# Altium schematic sheet Top.SchDoc: HPBI Controller (part 2 of 2)
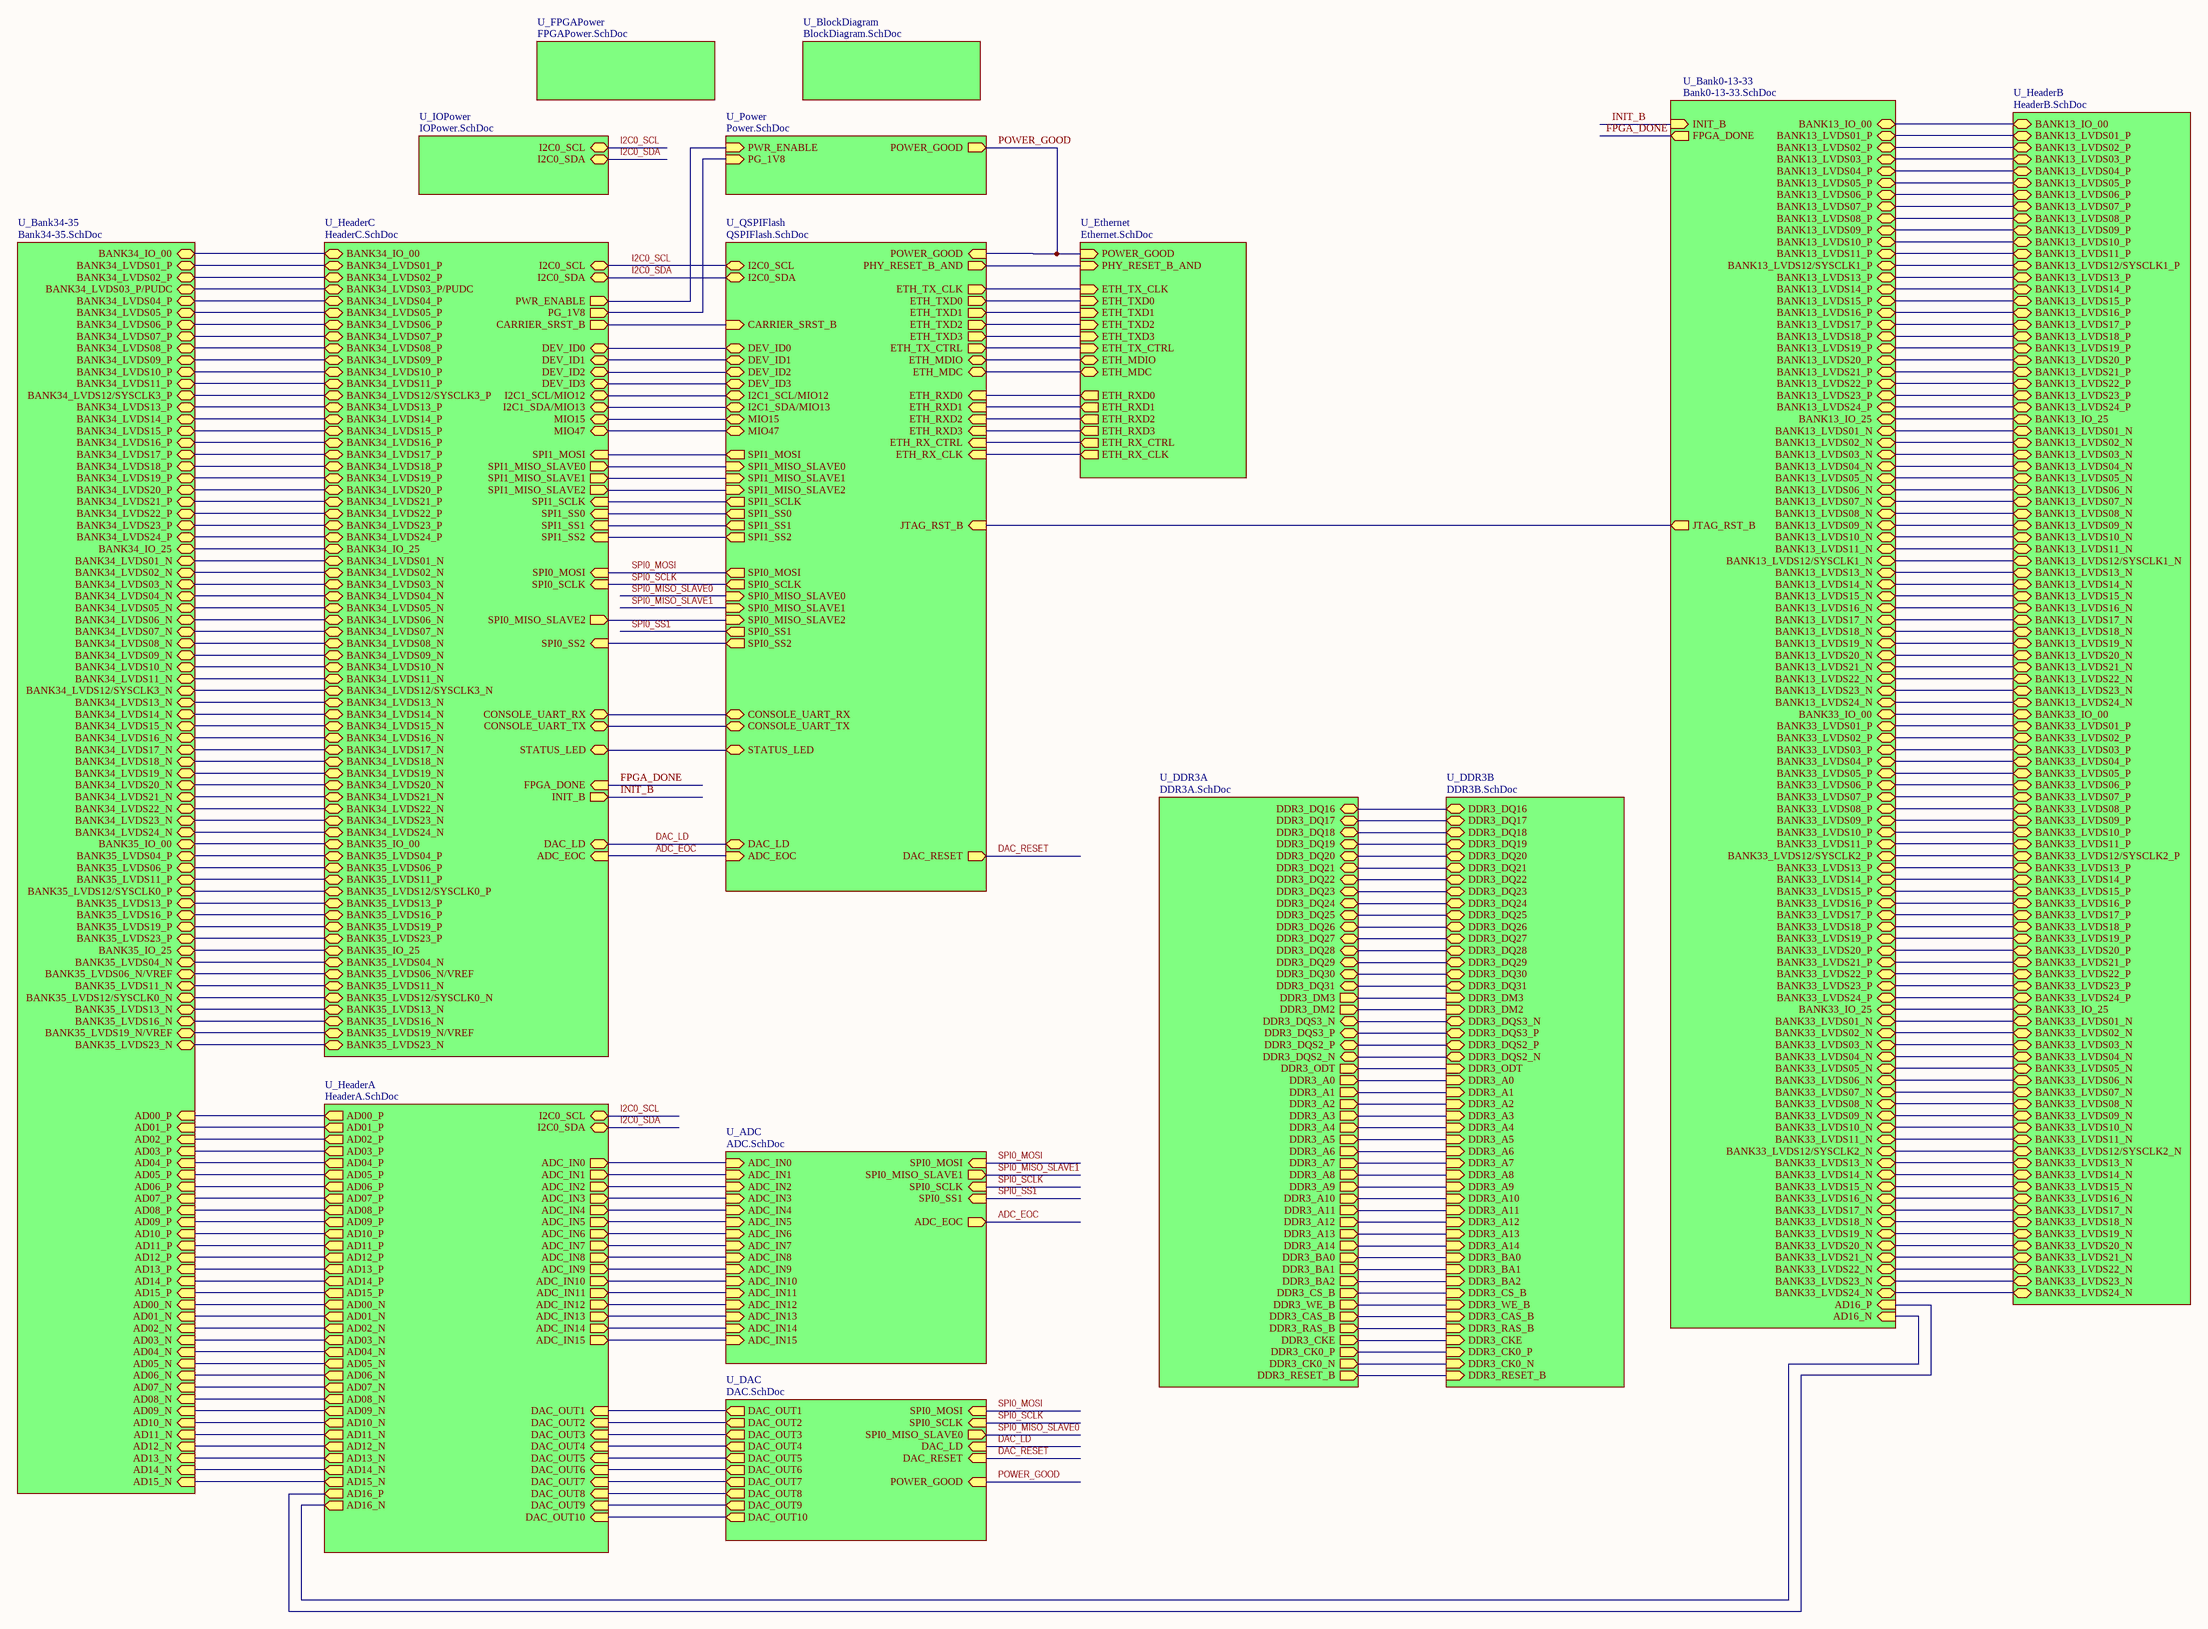
[diagram p1: Top.SchDoc]

## Nets
ADC_EOC: sheet U_ADC/ADC_EOC, sheet U_HeaderC/ADC_EOC, sheet U_QSPIFlash/ADC_EOC
DAC_LD: sheet U_DAC/DAC_LD, sheet U_HeaderC/DAC_LD, sheet U_QSPIFlash/DAC_LD
DAC_RESET: sheet U_DAC/DAC_RESET, sheet U_QSPIFlash/DAC_RESET
FPGA_DONE: sheet U_Bank0-13-33/FPGA_DONE, sheet U_HeaderC/FPGA_DONE
I2C0_SCL: sheet U_HeaderA/I2C0_SCL, sheet U_HeaderC/I2C0_SCL, sheet U_IOPower/I2C0_SCL, sheet U_QSPIFlash/I2C0_SCL
I2C0_SDA: sheet U_HeaderA/I2C0_SDA, sheet U_HeaderC/I2C0_SDA, sheet U_IOPower/I2C0_SDA, sheet U_QSPIFlash/I2C0_SDA
INIT_B: sheet U_Bank0-13-33/INIT_B, sheet U_HeaderC/INIT_B
POWER_GOOD: sheet U_DAC/POWER_GOOD, sheet U_Ethernet/POWER_GOOD, sheet U_QSPIFlash/POWER_GOOD, sheet U_Power/POWER_GOOD
SPI0_MISO_SLAVE0: sheet U_DAC/SPI0_MISO_SLAVE0, sheet U_QSPIFlash/SPI0_MISO_SLAVE0
SPI0_MISO_SLAVE1: sheet U_ADC/SPI0_MISO_SLAVE1, sheet U_QSPIFlash/SPI0_MISO_SLAVE1
SPI0_MOSI: sheet U_ADC/SPI0_MOSI, sheet U_DAC/SPI0_MOSI, sheet U_HeaderC/SPI0_MOSI, sheet U_QSPIFlash/SPI0_MOSI
SPI0_SCLK: sheet U_ADC/SPI0_SCLK, sheet U_DAC/SPI0_SCLK, sheet U_HeaderC/SPI0_SCLK, sheet U_QSPIFlash/SPI0_SCLK
SPI0_SS1: sheet U_ADC/SPI0_SS1, sheet U_QSPIFlash/SPI0_SS1
(unnamed): sheet U_ADC/ADC_IN0, sheet U_HeaderA/ADC_IN0
(unnamed): sheet U_ADC/ADC_IN1, sheet U_HeaderA/ADC_IN1
(unnamed): sheet U_ADC/ADC_IN2, sheet U_HeaderA/ADC_IN2
(unnamed): sheet U_ADC/ADC_IN3, sheet U_HeaderA/ADC_IN3
(unnamed): sheet U_ADC/ADC_IN4, sheet U_HeaderA/ADC_IN4
(unnamed): sheet U_ADC/ADC_IN5, sheet U_HeaderA/ADC_IN5
(unnamed): sheet U_ADC/ADC_IN6, sheet U_HeaderA/ADC_IN6
(unnamed): sheet U_ADC/ADC_IN7, sheet U_HeaderA/ADC_IN7
(unnamed): sheet U_ADC/ADC_IN8, sheet U_HeaderA/ADC_IN8
(unnamed): sheet U_ADC/ADC_IN9, sheet U_HeaderA/ADC_IN9
(unnamed): sheet U_ADC/ADC_IN10, sheet U_HeaderA/ADC_IN10
(unnamed): sheet U_ADC/ADC_IN11, sheet U_HeaderA/ADC_IN11
(unnamed): sheet U_ADC/ADC_IN12, sheet U_HeaderA/ADC_IN12
(unnamed): sheet U_ADC/ADC_IN13, sheet U_HeaderA/ADC_IN13
(unnamed): sheet U_ADC/ADC_IN14, sheet U_HeaderA/ADC_IN14
(unnamed): sheet U_ADC/ADC_IN15, sheet U_HeaderA/ADC_IN15
(unnamed): sheet U_Bank0-13-33/BANK13_IO_00, sheet U_HeaderB/BANK13_IO_00
(unnamed): sheet U_Bank0-13-33/BANK13_LVDS01_P, sheet U_HeaderB/BANK13_LVDS01_P
(unnamed): sheet U_Bank0-13-33/BANK13_LVDS02_P, sheet U_HeaderB/BANK13_LVDS02_P
(unnamed): sheet U_Bank0-13-33/BANK13_LVDS03_P, sheet U_HeaderB/BANK13_LVDS03_P
(unnamed): sheet U_Bank0-13-33/BANK13_LVDS04_P, sheet U_HeaderB/BANK13_LVDS04_P
(unnamed): sheet U_Bank0-13-33/BANK13_LVDS05_P, sheet U_HeaderB/BANK13_LVDS05_P
(unnamed): sheet U_Bank0-13-33/BANK13_LVDS06_P, sheet U_HeaderB/BANK13_LVDS06_P
(unnamed): sheet U_Bank0-13-33/BANK13_LVDS07_P, sheet U_HeaderB/BANK13_LVDS07_P
(unnamed): sheet U_Bank0-13-33/BANK13_LVDS08_P, sheet U_HeaderB/BANK13_LVDS08_P
(unnamed): sheet U_Bank0-13-33/BANK13_LVDS09_P, sheet U_HeaderB/BANK13_LVDS09_P
(unnamed): sheet U_Bank0-13-33/BANK13_LVDS10_P, sheet U_HeaderB/BANK13_LVDS10_P
(unnamed): sheet U_Bank0-13-33/BANK13_LVDS11_P, sheet U_HeaderB/BANK13_LVDS11_P
(unnamed): sheet U_Bank0-13-33/BANK13_LVDS13_P, sheet U_HeaderB/BANK13_LVDS13_P
(unnamed): sheet U_Bank0-13-33/BANK13_LVDS14_P, sheet U_HeaderB/BANK13_LVDS14_P
(unnamed): sheet U_Bank0-13-33/BANK13_LVDS15_P, sheet U_HeaderB/BANK13_LVDS15_P
(unnamed): sheet U_Bank0-13-33/BANK13_LVDS16_P, sheet U_HeaderB/BANK13_LVDS16_P
(unnamed): sheet U_Bank0-13-33/BANK13_LVDS17_P, sheet U_HeaderB/BANK13_LVDS17_P
(unnamed): sheet U_Bank0-13-33/BANK13_LVDS18_P, sheet U_HeaderB/BANK13_LVDS18_P
(unnamed): sheet U_Bank0-13-33/BANK13_LVDS19_P, sheet U_HeaderB/BANK13_LVDS19_P
(unnamed): sheet U_Bank0-13-33/BANK13_LVDS20_P, sheet U_HeaderB/BANK13_LVDS20_P
(unnamed): sheet U_Bank0-13-33/BANK13_LVDS21_P, sheet U_HeaderB/BANK13_LVDS21_P
(unnamed): sheet U_Bank0-13-33/BANK13_LVDS22_P, sheet U_HeaderB/BANK13_LVDS22_P
(unnamed): sheet U_Bank0-13-33/BANK13_LVDS23_P, sheet U_HeaderB/BANK13_LVDS23_P
(unnamed): sheet U_Bank0-13-33/BANK13_LVDS24_P, sheet U_HeaderB/BANK13_LVDS24_P
(unnamed): sheet U_Bank0-13-33/BANK13_IO_25, sheet U_HeaderB/BANK13_IO_25
(unnamed): sheet U_Bank0-13-33/BANK13_LVDS01_N, sheet U_HeaderB/BANK13_LVDS01_N
(unnamed): sheet U_Bank0-13-33/BANK13_LVDS02_N, sheet U_HeaderB/BANK13_LVDS02_N
(unnamed): sheet U_Bank0-13-33/BANK13_LVDS03_N, sheet U_HeaderB/BANK13_LVDS03_N
(unnamed): sheet U_Bank0-13-33/BANK13_LVDS04_N, sheet U_HeaderB/BANK13_LVDS04_N
(unnamed): sheet U_Bank0-13-33/BANK13_LVDS05_N, sheet U_HeaderB/BANK13_LVDS05_N
(unnamed): sheet U_Bank0-13-33/BANK13_LVDS06_N, sheet U_HeaderB/BANK13_LVDS06_N
(unnamed): sheet U_Bank0-13-33/BANK13_LVDS07_N, sheet U_HeaderB/BANK13_LVDS07_N
(unnamed): sheet U_Bank0-13-33/BANK13_LVDS08_N, sheet U_HeaderB/BANK13_LVDS08_N
(unnamed): sheet U_Bank0-13-33/BANK13_LVDS09_N, sheet U_HeaderB/BANK13_LVDS09_N
(unnamed): sheet U_Bank0-13-33/BANK13_LVDS10_N, sheet U_HeaderB/BANK13_LVDS10_N
(unnamed): sheet U_Bank0-13-33/BANK13_LVDS11_N, sheet U_HeaderB/BANK13_LVDS11_N
(unnamed): sheet U_Bank0-13-33/BANK13_LVDS13_N, sheet U_HeaderB/BANK13_LVDS13_N
(unnamed): sheet U_Bank0-13-33/BANK13_LVDS14_N, sheet U_HeaderB/BANK13_LVDS14_N
(unnamed): sheet U_Bank0-13-33/BANK13_LVDS15_N, sheet U_HeaderB/BANK13_LVDS15_N
(unnamed): sheet U_Bank0-13-33/BANK13_LVDS16_N, sheet U_HeaderB/BANK13_LVDS16_N
(unnamed): sheet U_Bank0-13-33/BANK13_LVDS17_N, sheet U_HeaderB/BANK13_LVDS17_N
(unnamed): sheet U_Bank0-13-33/BANK13_LVDS18_N, sheet U_HeaderB/BANK13_LVDS18_N
(unnamed): sheet U_Bank0-13-33/BANK13_LVDS19_N, sheet U_HeaderB/BANK13_LVDS19_N
(unnamed): sheet U_Bank0-13-33/BANK13_LVDS20_N, sheet U_HeaderB/BANK13_LVDS20_N
(unnamed): sheet U_Bank0-13-33/BANK13_LVDS21_N, sheet U_HeaderB/BANK13_LVDS21_N
(unnamed): sheet U_Bank0-13-33/BANK13_LVDS22_N, sheet U_HeaderB/BANK13_LVDS22_N
(unnamed): sheet U_Bank0-13-33/BANK13_LVDS23_N, sheet U_HeaderB/BANK13_LVDS23_N
(unnamed): sheet U_Bank0-13-33/BANK13_LVDS24_N, sheet U_HeaderB/BANK13_LVDS24_N
(unnamed): sheet U_Bank0-13-33/BANK33_IO_00, sheet U_HeaderB/BANK33_IO_00
(unnamed): sheet U_Bank0-13-33/BANK33_LVDS01_P, sheet U_HeaderB/BANK33_LVDS01_P
(unnamed): sheet U_Bank0-13-33/BANK33_LVDS02_P, sheet U_HeaderB/BANK33_LVDS02_P
(unnamed): sheet U_Bank0-13-33/BANK33_LVDS03_P, sheet U_HeaderB/BANK33_LVDS03_P
(unnamed): sheet U_Bank0-13-33/BANK33_LVDS04_P, sheet U_HeaderB/BANK33_LVDS04_P
(unnamed): sheet U_Bank0-13-33/BANK33_LVDS05_P, sheet U_HeaderB/BANK33_LVDS05_P
(unnamed): sheet U_Bank0-13-33/BANK33_LVDS06_P, sheet U_HeaderB/BANK33_LVDS06_P
(unnamed): sheet U_Bank0-13-33/BANK33_LVDS07_P, sheet U_HeaderB/BANK33_LVDS07_P
(unnamed): sheet U_Bank0-13-33/BANK33_LVDS08_P, sheet U_HeaderB/BANK33_LVDS08_P
(unnamed): sheet U_Bank0-13-33/BANK33_LVDS09_P, sheet U_HeaderB/BANK33_LVDS09_P
(unnamed): sheet U_Bank0-13-33/BANK33_LVDS10_P, sheet U_HeaderB/BANK33_LVDS10_P
(unnamed): sheet U_Bank0-13-33/BANK33_LVDS11_P, sheet U_HeaderB/BANK33_LVDS11_P
(unnamed): sheet U_Bank0-13-33/BANK33_LVDS13_P, sheet U_HeaderB/BANK33_LVDS13_P
(unnamed): sheet U_Bank0-13-33/BANK33_LVDS14_P, sheet U_HeaderB/BANK33_LVDS14_P
(unnamed): sheet U_Bank0-13-33/BANK33_LVDS15_P, sheet U_HeaderB/BANK33_LVDS15_P
(unnamed): sheet U_Bank0-13-33/BANK33_LVDS16_P, sheet U_HeaderB/BANK33_LVDS16_P
(unnamed): sheet U_Bank0-13-33/BANK33_LVDS17_P, sheet U_HeaderB/BANK33_LVDS17_P
(unnamed): sheet U_Bank0-13-33/BANK33_LVDS18_P, sheet U_HeaderB/BANK33_LVDS18_P
(unnamed): sheet U_Bank0-13-33/BANK33_LVDS19_P, sheet U_HeaderB/BANK33_LVDS19_P
(unnamed): sheet U_Bank0-13-33/BANK33_LVDS20_P, sheet U_HeaderB/BANK33_LVDS20_P
(unnamed): sheet U_Bank0-13-33/BANK33_LVDS21_P, sheet U_HeaderB/BANK33_LVDS21_P
(unnamed): sheet U_Bank0-13-33/BANK33_LVDS22_P, sheet U_HeaderB/BANK33_LVDS22_P
(unnamed): sheet U_Bank0-13-33/BANK33_LVDS23_P, sheet U_HeaderB/BANK33_LVDS23_P
(unnamed): sheet U_Bank0-13-33/BANK33_LVDS24_P, sheet U_HeaderB/BANK33_LVDS24_P
(unnamed): sheet U_Bank0-13-33/BANK33_IO_25, sheet U_HeaderB/BANK33_IO_25
(unnamed): sheet U_Bank0-13-33/BANK33_LVDS01_N, sheet U_HeaderB/BANK33_LVDS01_N
(unnamed): sheet U_Bank0-13-33/BANK33_LVDS02_N, sheet U_HeaderB/BANK33_LVDS02_N
(unnamed): sheet U_Bank0-13-33/BANK33_LVDS03_N, sheet U_HeaderB/BANK33_LVDS03_N
(unnamed): sheet U_Bank0-13-33/BANK33_LVDS04_N, sheet U_HeaderB/BANK33_LVDS04_N
(unnamed): sheet U_Bank0-13-33/BANK33_LVDS05_N, sheet U_HeaderB/BANK33_LVDS05_N
(unnamed): sheet U_Bank0-13-33/BANK33_LVDS06_N, sheet U_HeaderB/BANK33_LVDS06_N
(unnamed): sheet U_Bank0-13-33/BANK33_LVDS07_N, sheet U_HeaderB/BANK33_LVDS07_N
(unnamed): sheet U_Bank0-13-33/BANK33_LVDS08_N, sheet U_HeaderB/BANK33_LVDS08_N
(unnamed): sheet U_Bank0-13-33/BANK33_LVDS09_N, sheet U_HeaderB/BANK33_LVDS09_N
(unnamed): sheet U_Bank0-13-33/BANK33_LVDS10_N, sheet U_HeaderB/BANK33_LVDS10_N
(unnamed): sheet U_Bank0-13-33/BANK33_LVDS11_N, sheet U_HeaderB/BANK33_LVDS11_N
(unnamed): sheet U_Bank0-13-33/BANK33_LVDS13_N, sheet U_HeaderB/BANK33_LVDS13_N
(unnamed): sheet U_Bank0-13-33/BANK33_LVDS14_N, sheet U_HeaderB/BANK33_LVDS14_N
(unnamed): sheet U_Bank0-13-33/BANK33_LVDS15_N, sheet U_HeaderB/BANK33_LVDS15_N
(unnamed): sheet U_Bank0-13-33/BANK33_LVDS16_N, sheet U_HeaderB/BANK33_LVDS16_N
(unnamed): sheet U_Bank0-13-33/BANK33_LVDS17_N, sheet U_HeaderB/BANK33_LVDS17_N
(unnamed): sheet U_Bank0-13-33/BANK33_LVDS18_N, sheet U_HeaderB/BANK33_LVDS18_N
(unnamed): sheet U_Bank0-13-33/BANK33_LVDS19_N, sheet U_HeaderB/BANK33_LVDS19_N
(unnamed): sheet U_Bank0-13-33/BANK33_LVDS20_N, sheet U_HeaderB/BANK33_LVDS20_N
(unnamed): sheet U_Bank0-13-33/BANK33_LVDS21_N, sheet U_HeaderB/BANK33_LVDS21_N
(unnamed): sheet U_Bank0-13-33/BANK33_LVDS22_N, sheet U_HeaderB/BANK33_LVDS22_N
(unnamed): sheet U_Bank0-13-33/BANK33_LVDS23_N, sheet U_HeaderB/BANK33_LVDS23_N
(unnamed): sheet U_Bank0-13-33/BANK33_LVDS24_N, sheet U_HeaderB/BANK33_LVDS24_N
(unnamed): sheet U_Bank0-13-33/AD16_P, sheet U_HeaderA/AD16_P
(unnamed): sheet U_Bank0-13-33/AD16_N, sheet U_HeaderA/AD16_N
(unnamed): sheet U_Bank0-13-33/JTAG_RST_B, sheet U_QSPIFlash/JTAG_RST_B
(unnamed): sheet U_Bank0-13-33/BANK13_LVDS12/SYSCLK1_P, sheet U_HeaderB/BANK13_LVDS12/SYSCLK1_P
(unnamed): sheet U_Bank0-13-33/BANK13_LVDS12/SYSCLK1_N, sheet U_HeaderB/BANK13_LVDS12/SYSCLK1_N
(unnamed): sheet U_Bank0-13-33/BANK33_LVDS12/SYSCLK2_P, sheet U_HeaderB/BANK33_LVDS12/SYSCLK2_P
(unnamed): sheet U_Bank0-13-33/BANK33_LVDS12/SYSCLK2_N, sheet U_HeaderB/BANK33_LVDS12/SYSCLK2_N
(unnamed): sheet U_Bank34-35/BANK34_IO_00, sheet U_HeaderC/BANK34_IO_00
(unnamed): sheet U_Bank34-35/BANK34_LVDS01_P, sheet U_HeaderC/BANK34_LVDS01_P
(unnamed): sheet U_Bank34-35/BANK34_LVDS02_P, sheet U_HeaderC/BANK34_LVDS02_P
(unnamed): sheet U_Bank34-35/BANK34_LVDS03_P/PUDC, sheet U_HeaderC/BANK34_LVDS03_P/PUDC
(unnamed): sheet U_Bank34-35/BANK34_LVDS04_P, sheet U_HeaderC/BANK34_LVDS04_P
(unnamed): sheet U_Bank34-35/BANK34_LVDS05_P, sheet U_HeaderC/BANK34_LVDS05_P
(unnamed): sheet U_Bank34-35/BANK34_LVDS06_P, sheet U_HeaderC/BANK34_LVDS06_P
(unnamed): sheet U_Bank34-35/BANK34_LVDS07_P, sheet U_HeaderC/BANK34_LVDS07_P
(unnamed): sheet U_Bank34-35/BANK34_LVDS08_P, sheet U_HeaderC/BANK34_LVDS08_P
(unnamed): sheet U_Bank34-35/BANK34_LVDS09_P, sheet U_HeaderC/BANK34_LVDS09_P
(unnamed): sheet U_Bank34-35/BANK34_LVDS10_P, sheet U_HeaderC/BANK34_LVDS10_P
(unnamed): sheet U_Bank34-35/BANK34_LVDS11_P, sheet U_HeaderC/BANK34_LVDS11_P
(unnamed): sheet U_Bank34-35/BANK34_LVDS13_P, sheet U_HeaderC/BANK34_LVDS13_P
(unnamed): sheet U_Bank34-35/BANK34_LVDS14_P, sheet U_HeaderC/BANK34_LVDS14_P
(unnamed): sheet U_Bank34-35/BANK34_LVDS15_P, sheet U_HeaderC/BANK34_LVDS15_P
(unnamed): sheet U_Bank34-35/BANK34_LVDS16_P, sheet U_HeaderC/BANK34_LVDS16_P
(unnamed): sheet U_Bank34-35/BANK34_LVDS17_P, sheet U_HeaderC/BANK34_LVDS17_P
(unnamed): sheet U_Bank34-35/BANK34_LVDS18_P, sheet U_HeaderC/BANK34_LVDS18_P
(unnamed): sheet U_Bank34-35/BANK34_LVDS19_P, sheet U_HeaderC/BANK34_LVDS19_P
(unnamed): sheet U_Bank34-35/BANK34_LVDS20_P, sheet U_HeaderC/BANK34_LVDS20_P
(unnamed): sheet U_Bank34-35/BANK34_LVDS21_P, sheet U_HeaderC/BANK34_LVDS21_P
(unnamed): sheet U_Bank34-35/BANK34_LVDS22_P, sheet U_HeaderC/BANK34_LVDS22_P
(unnamed): sheet U_Bank34-35/BANK34_LVDS23_P, sheet U_HeaderC/BANK34_LVDS23_P
(unnamed): sheet U_Bank34-35/BANK34_LVDS24_P, sheet U_HeaderC/BANK34_LVDS24_P
(unnamed): sheet U_Bank34-35/BANK34_IO_25, sheet U_HeaderC/BANK34_IO_25
(unnamed): sheet U_Bank34-35/BANK34_LVDS01_N, sheet U_HeaderC/BANK34_LVDS01_N
(unnamed): sheet U_Bank34-35/BANK34_LVDS02_N, sheet U_HeaderC/BANK34_LVDS02_N
(unnamed): sheet U_Bank34-35/BANK34_LVDS03_N, sheet U_HeaderC/BANK34_LVDS03_N
(unnamed): sheet U_Bank34-35/BANK34_LVDS04_N, sheet U_HeaderC/BANK34_LVDS04_N
(unnamed): sheet U_Bank34-35/BANK34_LVDS05_N, sheet U_HeaderC/BANK34_LVDS05_N
(unnamed): sheet U_Bank34-35/BANK34_LVDS06_N, sheet U_HeaderC/BANK34_LVDS06_N
(unnamed): sheet U_Bank34-35/BANK34_LVDS07_N, sheet U_HeaderC/BANK34_LVDS07_N
(unnamed): sheet U_Bank34-35/BANK34_LVDS08_N, sheet U_HeaderC/BANK34_LVDS08_N
(unnamed): sheet U_Bank34-35/BANK34_LVDS09_N, sheet U_HeaderC/BANK34_LVDS09_N
(unnamed): sheet U_Bank34-35/BANK34_LVDS10_N, sheet U_HeaderC/BANK34_LVDS10_N
(unnamed): sheet U_Bank34-35/BANK34_LVDS11_N, sheet U_HeaderC/BANK34_LVDS11_N
(unnamed): sheet U_Bank34-35/BANK34_LVDS13_N, sheet U_HeaderC/BANK34_LVDS13_N
(unnamed): sheet U_Bank34-35/BANK34_LVDS14_N, sheet U_HeaderC/BANK34_LVDS14_N
(unnamed): sheet U_Bank34-35/BANK34_LVDS15_N, sheet U_HeaderC/BANK34_LVDS15_N
(unnamed): sheet U_Bank34-35/BANK34_LVDS16_N, sheet U_HeaderC/BANK34_LVDS16_N
(unnamed): sheet U_Bank34-35/BANK34_LVDS17_N, sheet U_HeaderC/BANK34_LVDS17_N
(unnamed): sheet U_Bank34-35/BANK34_LVDS18_N, sheet U_HeaderC/BANK34_LVDS18_N
(unnamed): sheet U_Bank34-35/BANK34_LVDS19_N, sheet U_HeaderC/BANK34_LVDS19_N
(unnamed): sheet U_Bank34-35/BANK34_LVDS20_N, sheet U_HeaderC/BANK34_LVDS20_N
(unnamed): sheet U_Bank34-35/BANK34_LVDS21_N, sheet U_HeaderC/BANK34_LVDS21_N
(unnamed): sheet U_Bank34-35/BANK34_LVDS22_N, sheet U_HeaderC/BANK34_LVDS22_N
(unnamed): sheet U_Bank34-35/BANK34_LVDS23_N, sheet U_HeaderC/BANK34_LVDS23_N
(unnamed): sheet U_Bank34-35/BANK34_LVDS24_N, sheet U_HeaderC/BANK34_LVDS24_N
(unnamed): sheet U_Bank34-35/BANK35_IO_00, sheet U_HeaderC/BANK35_IO_00
(unnamed): sheet U_Bank34-35/BANK35_LVDS04_P, sheet U_HeaderC/BANK35_LVDS04_P
(unnamed): sheet U_Bank34-35/BANK35_LVDS06_P, sheet U_HeaderC/BANK35_LVDS06_P
(unnamed): sheet U_Bank34-35/BANK35_LVDS11_P, sheet U_HeaderC/BANK35_LVDS11_P
(unnamed): sheet U_Bank34-35/BANK35_LVDS13_P, sheet U_HeaderC/BANK35_LVDS13_P
(unnamed): sheet U_Bank34-35/BANK35_LVDS16_P, sheet U_HeaderC/BANK35_LVDS16_P
(unnamed): sheet U_Bank34-35/BANK35_LVDS19_P, sheet U_HeaderC/BANK35_LVDS19_P
(unnamed): sheet U_Bank34-35/BANK35_LVDS23_P, sheet U_HeaderC/BANK35_LVDS23_P
(unnamed): sheet U_Bank34-35/BANK35_IO_25, sheet U_HeaderC/BANK35_IO_25
(unnamed): sheet U_Bank34-35/BANK35_LVDS04_N, sheet U_HeaderC/BANK35_LVDS04_N
(unnamed): sheet U_Bank34-35/BANK35_LVDS06_N/VREF, sheet U_HeaderC/BANK35_LVDS06_N/VREF
(unnamed): sheet U_Bank34-35/BANK35_LVDS11_N, sheet U_HeaderC/BANK35_LVDS11_N
(unnamed): sheet U_Bank34-35/BANK35_LVDS13_N, sheet U_HeaderC/BANK35_LVDS13_N
(unnamed): sheet U_Bank34-35/BANK35_LVDS16_N, sheet U_HeaderC/BANK35_LVDS16_N
(unnamed): sheet U_Bank34-35/BANK35_LVDS19_N/VREF, sheet U_HeaderC/BANK35_LVDS19_N/VREF
(unnamed): sheet U_Bank34-35/BANK35_LVDS23_N, sheet U_HeaderC/BANK35_LVDS23_N
(unnamed): sheet U_Bank34-35/AD00_P, sheet U_HeaderA/AD00_P
(unnamed): sheet U_Bank34-35/AD01_P, sheet U_HeaderA/AD01_P
(unnamed): sheet U_Bank34-35/AD02_P, sheet U_HeaderA/AD02_P
(unnamed): sheet U_Bank34-35/AD03_P, sheet U_HeaderA/AD03_P
(unnamed): sheet U_Bank34-35/AD04_P, sheet U_HeaderA/AD04_P
(unnamed): sheet U_Bank34-35/AD05_P, sheet U_HeaderA/AD05_P
(unnamed): sheet U_Bank34-35/AD06_P, sheet U_HeaderA/AD06_P
(unnamed): sheet U_Bank34-35/AD07_P, sheet U_HeaderA/AD07_P
(unnamed): sheet U_Bank34-35/AD08_P, sheet U_HeaderA/AD08_P
(unnamed): sheet U_Bank34-35/AD09_P, sheet U_HeaderA/AD09_P
(unnamed): sheet U_Bank34-35/AD10_P, sheet U_HeaderA/AD10_P
(unnamed): sheet U_Bank34-35/AD11_P, sheet U_HeaderA/AD11_P
(unnamed): sheet U_Bank34-35/AD12_P, sheet U_HeaderA/AD12_P
(unnamed): sheet U_Bank34-35/AD13_P, sheet U_HeaderA/AD13_P
(unnamed): sheet U_Bank34-35/AD14_P, sheet U_HeaderA/AD14_P
(unnamed): sheet U_Bank34-35/AD15_P, sheet U_HeaderA/AD15_P
(unnamed): sheet U_Bank34-35/AD00_N, sheet U_HeaderA/AD00_N
(unnamed): sheet U_Bank34-35/AD01_N, sheet U_HeaderA/AD01_N
(unnamed): sheet U_Bank34-35/AD02_N, sheet U_HeaderA/AD02_N
(unnamed): sheet U_Bank34-35/AD03_N, sheet U_HeaderA/AD03_N
(unnamed): sheet U_Bank34-35/AD04_N, sheet U_HeaderA/AD04_N
(unnamed): sheet U_Bank34-35/AD05_N, sheet U_HeaderA/AD05_N
(unnamed): sheet U_Bank34-35/AD06_N, sheet U_HeaderA/AD06_N
(unnamed): sheet U_Bank34-35/AD07_N, sheet U_HeaderA/AD07_N
(unnamed): sheet U_Bank34-35/AD08_N, sheet U_HeaderA/AD08_N
(unnamed): sheet U_Bank34-35/AD09_N, sheet U_HeaderA/AD09_N
(unnamed): sheet U_Bank34-35/AD10_N, sheet U_HeaderA/AD10_N
(unnamed): sheet U_Bank34-35/AD11_N, sheet U_HeaderA/AD11_N
(unnamed): sheet U_Bank34-35/AD12_N, sheet U_HeaderA/AD12_N
(unnamed): sheet U_Bank34-35/AD13_N, sheet U_HeaderA/AD13_N
(unnamed): sheet U_Bank34-35/AD14_N, sheet U_HeaderA/AD14_N
(unnamed): sheet U_Bank34-35/AD15_N, sheet U_HeaderA/AD15_N
(unnamed): sheet U_Bank34-35/BANK34_LVDS12/SYSCLK3_P, sheet U_HeaderC/BANK34_LVDS12/SYSCLK3_P
(unnamed): sheet U_Bank34-35/BANK34_LVDS12/SYSCLK3_N, sheet U_HeaderC/BANK34_LVDS12/SYSCLK3_N
(unnamed): sheet U_Bank34-35/BANK35_LVDS12/SYSCLK0_P, sheet U_HeaderC/BANK35_LVDS12/SYSCLK0_P
(unnamed): sheet U_Bank34-35/BANK35_LVDS12/SYSCLK0_N, sheet U_HeaderC/BANK35_LVDS12/SYSCLK0_N
(unnamed): sheet U_DAC/DAC_OUT1, sheet U_HeaderA/DAC_OUT1
(unnamed): sheet U_DAC/DAC_OUT2, sheet U_HeaderA/DAC_OUT2
(unnamed): sheet U_DAC/DAC_OUT3, sheet U_HeaderA/DAC_OUT3
(unnamed): sheet U_DAC/DAC_OUT4, sheet U_HeaderA/DAC_OUT4
(unnamed): sheet U_DAC/DAC_OUT5, sheet U_HeaderA/DAC_OUT5
(unnamed): sheet U_DAC/DAC_OUT6, sheet U_HeaderA/DAC_OUT6
(unnamed): sheet U_DAC/DAC_OUT7, sheet U_HeaderA/DAC_OUT7
(unnamed): sheet U_DAC/DAC_OUT8, sheet U_HeaderA/DAC_OUT8
(unnamed): sheet U_DAC/DAC_OUT9, sheet U_HeaderA/DAC_OUT9
(unnamed): sheet U_DAC/DAC_OUT10, sheet U_HeaderA/DAC_OUT10
(unnamed): sheet U_DDR3A/DDR3_DQ16, sheet U_DDR3B/DDR3_DQ16
(unnamed): sheet U_DDR3A/DDR3_DQ17, sheet U_DDR3B/DDR3_DQ17
(unnamed): sheet U_DDR3A/DDR3_DQ18, sheet U_DDR3B/DDR3_DQ18
(unnamed): sheet U_DDR3A/DDR3_DQ19, sheet U_DDR3B/DDR3_DQ19
(unnamed): sheet U_DDR3A/DDR3_DQ20, sheet U_DDR3B/DDR3_DQ20
(unnamed): sheet U_DDR3A/DDR3_DQ21, sheet U_DDR3B/DDR3_DQ21
(unnamed): sheet U_DDR3A/DDR3_DQ22, sheet U_DDR3B/DDR3_DQ22
(unnamed): sheet U_DDR3A/DDR3_DQ23, sheet U_DDR3B/DDR3_DQ23
(unnamed): sheet U_DDR3A/DDR3_DQ24, sheet U_DDR3B/DDR3_DQ24
(unnamed): sheet U_DDR3A/DDR3_DQ25, sheet U_DDR3B/DDR3_DQ25
(unnamed): sheet U_DDR3A/DDR3_DQ26, sheet U_DDR3B/DDR3_DQ26
(unnamed): sheet U_DDR3A/DDR3_DQ27, sheet U_DDR3B/DDR3_DQ27
(unnamed): sheet U_DDR3A/DDR3_DQ28, sheet U_DDR3B/DDR3_DQ28
(unnamed): sheet U_DDR3A/DDR3_DQ29, sheet U_DDR3B/DDR3_DQ29
(unnamed): sheet U_DDR3A/DDR3_DQ30, sheet U_DDR3B/DDR3_DQ30
(unnamed): sheet U_DDR3A/DDR3_DQ31, sheet U_DDR3B/DDR3_DQ31
(unnamed): sheet U_DDR3A/DDR3_DM2, sheet U_DDR3B/DDR3_DM2
(unnamed): sheet U_DDR3A/DDR3_DM3, sheet U_DDR3B/DDR3_DM3
(unnamed): sheet U_DDR3A/DDR3_DQS2_P, sheet U_DDR3B/DDR3_DQS2_P
(unnamed): sheet U_DDR3A/DDR3_DQS2_N, sheet U_DDR3B/DDR3_DQS2_N
(unnamed): sheet U_DDR3A/DDR3_DQS3_N, sheet U_DDR3B/DDR3_DQS3_N
(unnamed): sheet U_DDR3A/DDR3_DQS3_P, sheet U_DDR3B/DDR3_DQS3_P
(unnamed): sheet U_DDR3A/DDR3_A0, sheet U_DDR3B/DDR3_A0
(unnamed): sheet U_DDR3A/DDR3_A1, sheet U_DDR3B/DDR3_A1
(unnamed): sheet U_DDR3A/DDR3_A2, sheet U_DDR3B/DDR3_A2
(unnamed): sheet U_DDR3A/DDR3_A3, sheet U_DDR3B/DDR3_A3
(unnamed): sheet U_DDR3A/DDR3_A4, sheet U_DDR3B/DDR3_A4
(unnamed): sheet U_DDR3A/DDR3_A5, sheet U_DDR3B/DDR3_A5
(unnamed): sheet U_DDR3A/DDR3_A6, sheet U_DDR3B/DDR3_A6
(unnamed): sheet U_DDR3A/DDR3_A7, sheet U_DDR3B/DDR3_A7
(unnamed): sheet U_DDR3A/DDR3_A8, sheet U_DDR3B/DDR3_A8
(unnamed): sheet U_DDR3A/DDR3_A9, sheet U_DDR3B/DDR3_A9
(unnamed): sheet U_DDR3A/DDR3_A10, sheet U_DDR3B/DDR3_A10
(unnamed): sheet U_DDR3A/DDR3_A11, sheet U_DDR3B/DDR3_A11
(unnamed): sheet U_DDR3A/DDR3_A12, sheet U_DDR3B/DDR3_A12
(unnamed): sheet U_DDR3A/DDR3_A13, sheet U_DDR3B/DDR3_A13
(unnamed): sheet U_DDR3A/DDR3_A14, sheet U_DDR3B/DDR3_A14
(unnamed): sheet U_DDR3A/DDR3_BA0, sheet U_DDR3B/DDR3_BA0
(unnamed): sheet U_DDR3A/DDR3_BA1, sheet U_DDR3B/DDR3_BA1
(unnamed): sheet U_DDR3A/DDR3_BA2, sheet U_DDR3B/DDR3_BA2
(unnamed): sheet U_DDR3A/DDR3_CK0_P, sheet U_DDR3B/DDR3_CK0_P
(unnamed): sheet U_DDR3A/DDR3_CK0_N, sheet U_DDR3B/DDR3_CK0_N
(unnamed): sheet U_DDR3A/DDR3_CKE, sheet U_DDR3B/DDR3_CKE
(unnamed): sheet U_DDR3A/DDR3_CS_B, sheet U_DDR3B/DDR3_CS_B
(unnamed): sheet U_DDR3A/DDR3_RAS_B, sheet U_DDR3B/DDR3_RAS_B
(unnamed): sheet U_DDR3A/DDR3_CAS_B, sheet U_DDR3B/DDR3_CAS_B
(unnamed): sheet U_DDR3A/DDR3_WE_B, sheet U_DDR3B/DDR3_WE_B
(unnamed): sheet U_DDR3A/DDR3_ODT, sheet U_DDR3B/DDR3_ODT
(unnamed): sheet U_DDR3A/DDR3_RESET_B, sheet U_DDR3B/DDR3_RESET_B
(unnamed): sheet U_Ethernet/ETH_TX_CLK, sheet U_QSPIFlash/ETH_TX_CLK
(unnamed): sheet U_Ethernet/ETH_TXD0, sheet U_QSPIFlash/ETH_TXD0
(unnamed): sheet U_Ethernet/ETH_TXD1, sheet U_QSPIFlash/ETH_TXD1
(unnamed): sheet U_Ethernet/ETH_TXD2, sheet U_QSPIFlash/ETH_TXD2
(unnamed): sheet U_Ethernet/ETH_TXD3, sheet U_QSPIFlash/ETH_TXD3
(unnamed): sheet U_Ethernet/ETH_RXD0, sheet U_QSPIFlash/ETH_RXD0
(unnamed): sheet U_Ethernet/ETH_RXD1, sheet U_QSPIFlash/ETH_RXD1
(unnamed): sheet U_Ethernet/ETH_RXD2, sheet U_QSPIFlash/ETH_RXD2
(unnamed): sheet U_Ethernet/ETH_RXD3, sheet U_QSPIFlash/ETH_RXD3
(unnamed): sheet U_Ethernet/ETH_TX_CTRL, sheet U_QSPIFlash/ETH_TX_CTRL
(unnamed): sheet U_Ethernet/ETH_RX_CTRL, sheet U_QSPIFlash/ETH_RX_CTRL
(unnamed): sheet U_Ethernet/ETH_RX_CLK, sheet U_QSPIFlash/ETH_RX_CLK
(unnamed): sheet U_Ethernet/ETH_MDIO, sheet U_QSPIFlash/ETH_MDIO
(unnamed): sheet U_Ethernet/ETH_MDC, sheet U_QSPIFlash/ETH_MDC
(unnamed): sheet U_Ethernet/PHY_RESET_B_AND, sheet U_QSPIFlash/PHY_RESET_B_AND
(unnamed): sheet U_HeaderC/DEV_ID0, sheet U_QSPIFlash/DEV_ID0
(unnamed): sheet U_HeaderC/DEV_ID1, sheet U_QSPIFlash/DEV_ID1
(unnamed): sheet U_HeaderC/DEV_ID2, sheet U_QSPIFlash/DEV_ID2
(unnamed): sheet U_HeaderC/I2C1_SCL/MIO12, sheet U_QSPIFlash/I2C1_SCL/MIO12
(unnamed): sheet U_HeaderC/I2C1_SDA/MIO13, sheet U_QSPIFlash/I2C1_SDA/MIO13
(unnamed): sheet U_HeaderC/SPI1_MOSI, sheet U_QSPIFlash/SPI1_MOSI
(unnamed): sheet U_HeaderC/SPI1_SCLK, sheet U_QSPIFlash/SPI1_SCLK
(unnamed): sheet U_HeaderC/SPI1_SS0, sheet U_QSPIFlash/SPI1_SS0
(unnamed): sheet U_HeaderC/SPI1_SS1, sheet U_QSPIFlash/SPI1_SS1
(unnamed): sheet U_HeaderC/SPI1_SS2, sheet U_QSPIFlash/SPI1_SS2
(unnamed): sheet U_HeaderC/CONSOLE_UART_RX, sheet U_QSPIFlash/CONSOLE_UART_RX
(unnamed): sheet U_HeaderC/CONSOLE_UART_TX, sheet U_QSPIFlash/CONSOLE_UART_TX
(unnamed): sheet U_HeaderC/DEV_ID3, sheet U_QSPIFlash/DEV_ID3
(unnamed): sheet U_HeaderC/CARRIER_SRST_B, sheet U_QSPIFlash/CARRIER_SRST_B
(unnamed): sheet U_HeaderC/STATUS_LED, sheet U_QSPIFlash/STATUS_LED
(unnamed): sheet U_HeaderC/PWR_ENABLE, sheet U_Power/PWR_ENABLE
(unnamed): sheet U_HeaderC/PG_1V8, sheet U_Power/PG_1V8
(unnamed): sheet U_HeaderC/MIO15, sheet U_QSPIFlash/MIO15
(unnamed): sheet U_HeaderC/SPI1_MISO_SLAVE0, sheet U_QSPIFlash/SPI1_MISO_SLAVE0
(unnamed): sheet U_HeaderC/SPI1_MISO_SLAVE1, sheet U_QSPIFlash/SPI1_MISO_SLAVE1
(unnamed): sheet U_HeaderC/SPI1_MISO_SLAVE2, sheet U_QSPIFlash/SPI1_MISO_SLAVE2
(unnamed): sheet U_HeaderC/SPI0_SS2, sheet U_QSPIFlash/SPI0_SS2
(unnamed): sheet U_HeaderC/SPI0_MISO_SLAVE2, sheet U_QSPIFlash/SPI0_MISO_SLAVE2
(unnamed): sheet U_HeaderC/MIO47, sheet U_QSPIFlash/MIO47

## Notes on the sheet
- REV.
- DESCRIPTION
- DATE
- APPROVED
- TITLE
- SHEET
- CONFIG.
- PROJECT
- SIZE
- C
- SCH P/N.
- DRAWN
- OF